# Altium schematic sheet pokey-switch-board.SchDoc: Orthoboxes - Triangulation Tactile Switch Board
size A
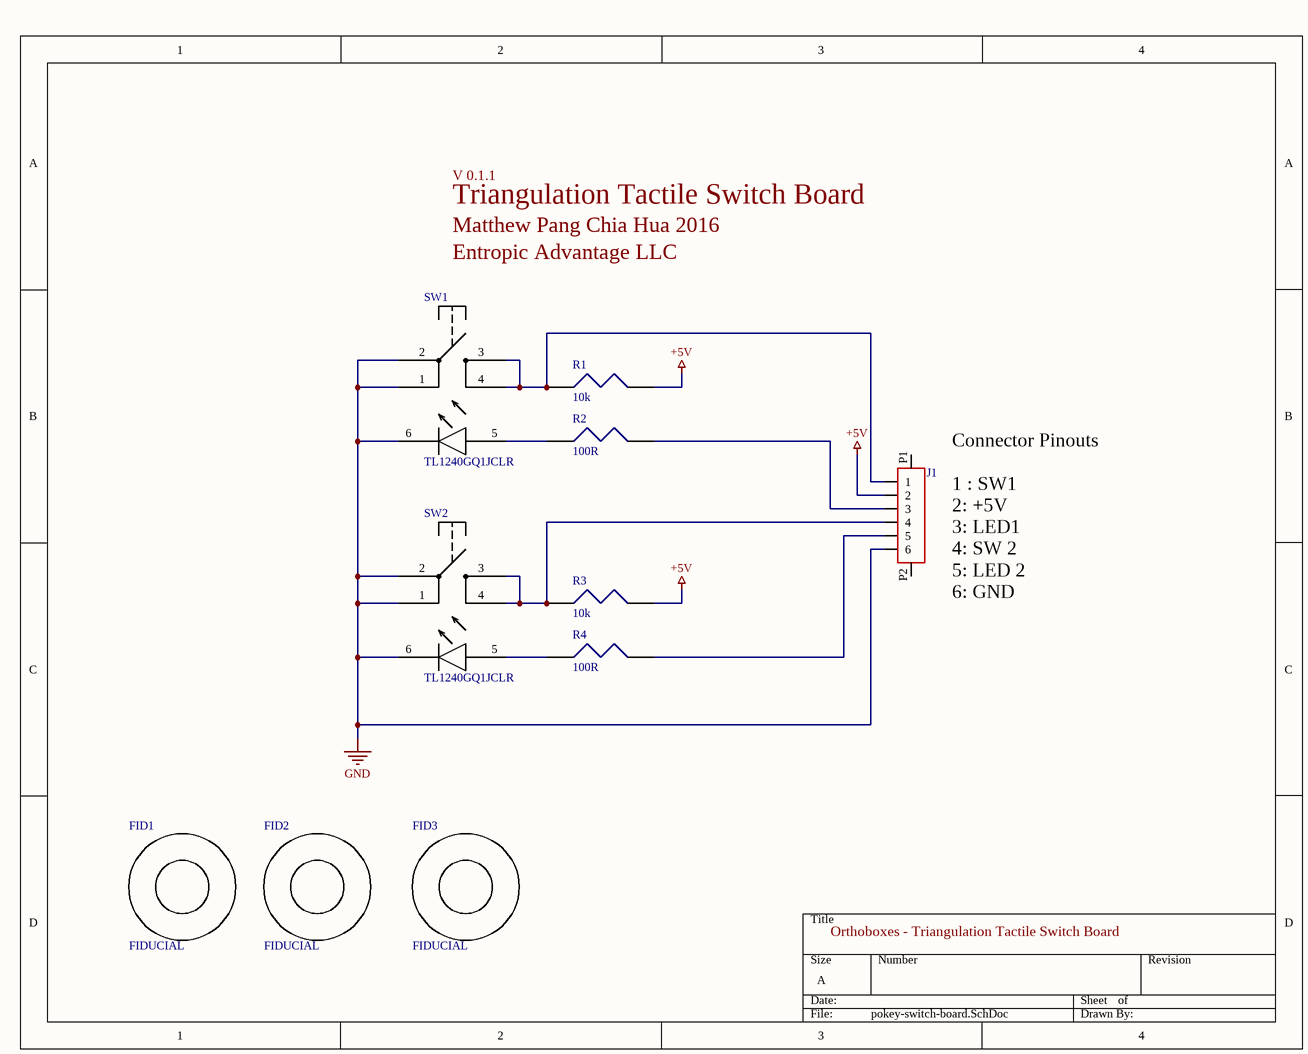
[diagram p0: pokey-switch-board.SchDoc]

## Parts
FID1  FIDUCIAL  [FID]  (no BOM)
FID2  FIDUCIAL  [FID]  (no BOM)
FID3  FIDUCIAL  [FID]  (no BOM)
J1  5034800600  [MOLEX 503480-0600]  (value not drawn)
R1  10k  [RESC2012X07N_SAMSUNG]
R2  100R  [RESC2012X07N_SAMSUNG]
R3  10k  [RESC2012X07N_SAMSUNG]
R4  100R  [RESC2012X07N_SAMSUNG]
SW1  TL1240GQ1JCLR  [TL1240]
SW2  TL1240GQ1JCLR  [TL1240]

## Nets
+5V: J1.2 R1.2 R3.2
GND: J1.6 SW1.1 SW1.2 SW1.6 SW2.1 SW2.2 SW2.6
NetJ1_1: J1.1 R1.1 SW1.3 SW1.4
NetJ1_3: J1.3 R2.2
NetJ1_4: J1.4 R3.1 SW2.3 SW2.4
NetJ1_5: J1.5 R4.2
NetR2_1: R2.1 SW1.5
NetR4_1: R4.1 SW2.5

Not connected (* = marked no-connect by the designer): J1 P1 P2

## Notes on the sheet
- V 0.1.1
- Triangulation Tactile Switch Board
- Matthew Pang Chia Hua 2016
- Entropic Advantage LLC
- (near J1) Connector Pinouts
  1 : SW1
  2: +5V
  3: LED1
  4: SW 2
  5: LED 2
  6: GND

## Library data of the parts
FID1-FID3 = Fiducial 1
J1 = 5034800600: CONN FFC FPC 6POS 0.50MM R/A; Manufacturer: Molex, LLC; Flat Flex Type: FFC, FPC; Connector/Contact Type: Contacts, Top and Bottom; Number of Positions: 6; Pitch: 0.020" (0.50mm); FFC, FCB Thickness: 0.30mm; Locking Feature: Flip Lock, Backlock; Cable End Type: Straight, Tapered; Actuator Material: Polyamide (PA), Nylon, Glass Filled; Voltage Rating: 50V; Material Flammability Rating: UL94 V-0, UL94 HB; Current Rating: 0.5A; Supplier 1: Digi-Key; Manufacturer Part Number: 5034800600; RoHS: RoHS Compliant; Category: Connectors, Interconnects; Stock 1: 16110; Pricing 1: 1=0.81, 10=0.714, 25=0.672, 50=0.6438, 100=0.6159, 250=0.55992, 500=0.50392, 1000=0.44792 (USD); Packaging: Cut Tape (CT); Mounting Type: Surface Mount, Right Angle; Termination: Solder; Height Above Board: 0.039" (1.00mm); Contact Material: Phosphor Bronze; Contact Finish: Gold; Housing Material: Liquid Crystal Polymer (LCP), Glass Filled; Features: Solder Retention; Operating Temperature: -40°C ~ 85°C; ComponentLink1URL: http://www.molex.com/pdm_docs/sd/5034800600_sd.pdf; ComponentLink1Description: http://www.molex.com/pdm_docs/sd/5034800600_sd.pdf; Supplier Part Number 1: WM1387CT-ND
R1 R3 = RC2012F103CS: RES SMD 10K OHM 1% 1/8W 0805; Manufacturer: Samsung Electro-Mechanics America, Inc.; Power (Watts): 0.125W, 1/8W; Temperature Coefficient: ±100ppm/°C; Supplier 1: Digi-Key; Manufacturer Part Number: RC2012F103CS; RoHS: RoHS Compliant; Category: Resistors; Stock 1: 234992; Pricing 1: 1=0.1, 10=0.022, 25=0.016, 50=0.0124, 100=0.0091, 500=0.00554, 1000=0.00408 (USD); Packaging: Cut Tape (CT); Resistance (Ohms): 10k; Tolerance: ±1%; Composition: Thick Film; Features: Moisture Resistant; Operating Temperature: -55°C ~ 155°C; Package / Case: 0805 (2012 Metric); Supplier Device Package: 0805 (2012 Metric); Size / Dimension: 0.079" L x 0.049" W (2.00mm x 1.25mm); Height: 0.024" (0.60mm); Number of Terminations: 2; ComponentLink1URL: http://media.digikey.com/pdf/Data%20Sheets/Samsung%20PDFs/RC_Series_ds.pdf; ComponentLink1Description: http://media.digikey.com/pdf/Data%20Sheets/Samsung%20PDFs/RC_Series_ds.pdf; Supplier Part Number 1: 1276-5332-1-ND
R2 R4 = RC2012F101CS: RES SMD 100 OHM 1% 1/8W 0805; Manufacturer: Samsung Electro-Mechanics America, Inc.; Resistance (Ohms): 100; Power (Watts): 0.125W, 1/8W; Temperature Coefficient: ±100ppm/°C; Supplier 1: Digi-Key; Manufacturer Part Number: RC2012F101CS; RoHS: RoHS Compliant; Category: Resistors; Stock 1: 60548; Pricing 1: 1=0.1, 10=0.022, 25=0.016, 50=0.0124, 100=0.0091, 500=0.00554, 1000=0.00408 (USD); Packaging: Cut Tape (CT); Tolerance: ±1%; Composition: Thick Film; Features: Moisture Resistant; Operating Temperature: -55°C ~ 155°C; Package / Case: 0805 (2012 Metric); Supplier Device Package: 0805 (2012 Metric); Size / Dimension: 0.079" L x 0.049" W (2.00mm x 1.25mm); Height: 0.024" (0.60mm); Number of Terminations: 2; ComponentLink1URL: http://media.digikey.com/pdf/Data%20Sheets/Samsung%20PDFs/RC_Series_ds.pdf; ComponentLink1Description: http://media.digikey.com/pdf/Data%20Sheets/Samsung%20PDFs/RC_Series_ds.pdf; Supplier Part Number 1: 1276-5224-1-ND
SW1 SW2 = TL1240GQ1JCLR: SWITCH TACTILE SPST-NO 0.05A 12V; Manufacturer: E-Switch; Switch Function: Off-Mom; Contact Rating @ Voltage: 0.05A @ 12VDC; Actuator Type: Square Button; Actuator Height off PCB, from Pins: 8.20mm; Actuator Orientation: Top Actuated; Outline: 6.00mm x 6.00mm; Illumination: Illuminated; Illumination Voltage (Nominal): 2.8 VDC; Illumination Type, Color: LED, Green; Operating Force: 160gf; Actuator Material: Polybutylene Terephthalate (PBT); Switch Travel: 0.25mm; Mechanical Life: 100,000 Cycles; Supplier 1: Digi-Key; Manufacturer Part Number: TL1240GQ1JCLR; RoHS: RoHS Compliant; Category: Switches; Stock 1: 2305; Pricing 1: 1=1.81, 10=1.745, 50=1.396, 100=1.3262, 250=1.29132, 500=1.2564, 1000=0.9772, 5000=0.9074 (USD); Packaging: Bulk; Circuit: SPST-NO; Mounting Type: Through Hole; Termination Style: PC Pin; Ingress Protection: -; Features: -; Operating Temperature: -20°C ~ 70°C; ComponentLink1URL: https://www.e-switch.com/system/asset/product_line/data_sheet/147/TL1240.pdf; ComponentLink1Description: https://www.e-switch.com/system/asset/product_line/data_sheet/147/TL1240.pdf; Supplier Part Number 1: EG4614-ND